# EAGLE schematic s16_panel_2 (EAGLE 7.3.0)

## Sheet 1 of 2
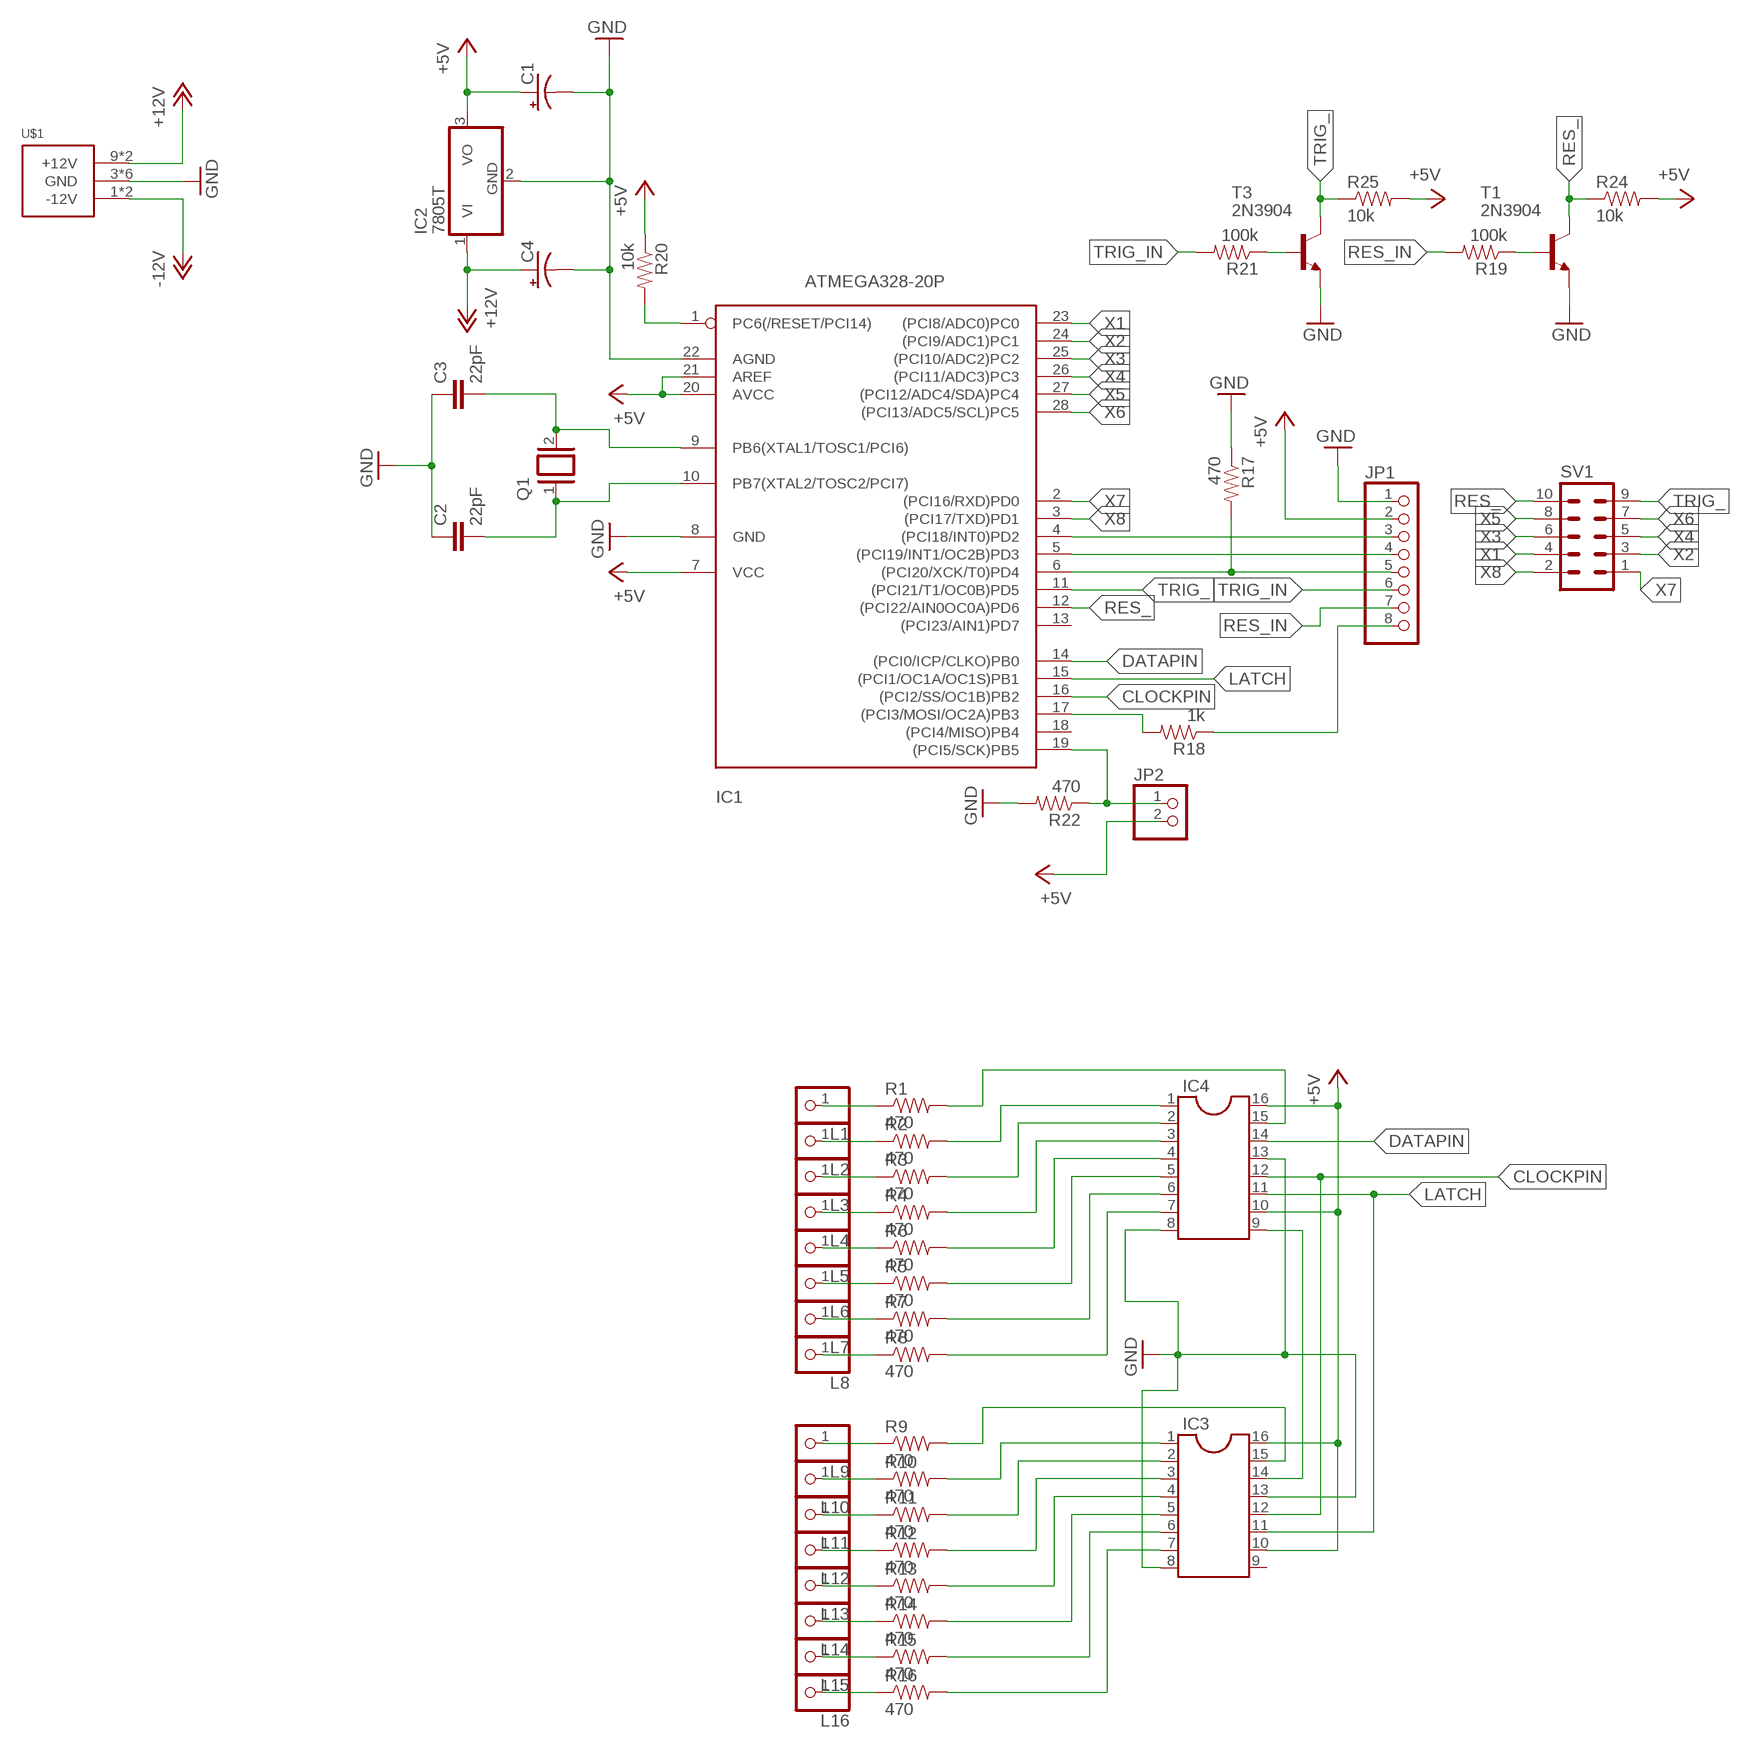
[diagram p0: schematic, sheet 1]

### Parts
C1  CAP_POLPTH2  [CPOL-RADIAL-10UF-25V]
C2  22pF  CAPEZ  [CAP-PTH-SMALLEZ]
C3  22pF  CAPEZ  [CAP-PTH-SMALLEZ]
C4  CAP_POLPTH2  [CPOL-RADIAL-10UF-25V]
IC1  ATMEGA328-20P  [DIL28-3]
IC2  7805T  [TO220H]
IC3  DIL16  [DIL16]
IC4  DIL16  [DIL16]
JP1  PINHD-1X8BIG  [1X08-BIG]
JP2  PINHD-1X2  [1X02]
L1  PINHD-1X1  [1X01]
L2  PINHD-1X1  [1X01]
L3  PINHD-1X1  [1X01]
L4  PINHD-1X1  [1X01]
L5  PINHD-1X1  [1X01]
L6  PINHD-1X1  [1X01]
L7  PINHD-1X1  [1X01]
L8  PINHD-1X1  [1X01]
L9  PINHD-1X1  [1X01]
L10  PINHD-1X1  [1X01]
L11  PINHD-1X1  [1X01]
L12  PINHD-1X1  [1X01]
L13  PINHD-1X1  [1X01]
L14  PINHD-1X1  [1X01]
L15  PINHD-1X1  [1X01]
L16  PINHD-1X1  [1X01]
Q1  XTAL/S  [QS]
R1  470  RESISTOR  [AXIAL-0.3]
R2  470  RESISTORAXIAL-0.3  [AXIAL-0.3]
R3  470  RESISTORAXIAL-0.3  [AXIAL-0.3]
R4  470  RESISTORAXIAL-0.3  [AXIAL-0.3]
R5  470  RESISTORAXIAL-0.3  [AXIAL-0.3]
R6  470  RESISTORAXIAL-0.3  [AXIAL-0.3]
R7  470  RESISTORAXIAL-0.3  [AXIAL-0.3]
R8  470  RESISTORAXIAL-0.3  [AXIAL-0.3]
R9  470  RESISTORAXIAL-0.3  [AXIAL-0.3]
R10  470  RESISTORAXIAL-0.3  [AXIAL-0.3]
R11  470  RESISTORAXIAL-0.3  [AXIAL-0.3]
R12  470  RESISTORAXIAL-0.3  [AXIAL-0.3]
R13  470  RESISTORAXIAL-0.3  [AXIAL-0.3]
R14  470  RESISTORAXIAL-0.3  [AXIAL-0.3]
R15  470  RESISTORAXIAL-0.3  [AXIAL-0.3]
R16  470  RESISTORAXIAL-0.3  [AXIAL-0.3]
R17  470  RESISTORAXIAL-0.3  [AXIAL-0.3]
R18  1k  RESISTORAXIAL-0.3  [AXIAL-0.3]
R19  100k  RESISTORAXIAL-0.3  [AXIAL-0.3]
R20  10k  RESISTORAXIAL-0.3  [AXIAL-0.3]
R21  100k  RESISTORAXIAL-0.3  [AXIAL-0.3]
R22  470  RESISTOR  [AXIAL-0.3]
R24  10k  RESISTORAXIAL-0.3  [AXIAL-0.3]
R25  10k  RESISTORAXIAL-0.3  [AXIAL-0.3]
SV1  MA05-2  [MA05-2]
T1  2N3904  [TO92]
T3  2N3904  [TO92]
U$1  POWER_SIMPLE10  [POWER_10]

### Nets
+5V: C1.1(+) IC1.7(VCC) IC1.20(AVCC) IC1.21(AREF) IC2.3(VO) IC3.10 IC3.16 IC4.10 IC4.16 JP1.2 JP2.2 R20.P$1 R24.P$2 R25.P$2
+12V: C4.1(+) IC2.1(VI) U$1.9(+12V) U$1.10(+12V)
-12V: U$1.1(-12V) U$1.2(-12V)
CLOCKPIN: IC1.16((PCI2/SS/OC1B)PB2) IC3.12 IC4.12
DATAPIN: IC1.14((PCI0/ICP/CLKO)PB0) IC4.14
GND: C1.2(-) C2.1 C3.1 C4.2(-) IC1.8(GND) IC1.22(AGND) IC2.2(GND) IC3.8 IC3.13 IC4.8 IC4.13 JP1.1 R17.P$1 R22.P$2 T1.3(E) T3.3(E) U$1.3(GND) U$1.4(GND) U$1.5(GND) U$1.6(GND) U$1.7(GND) U$1.8(GND)
LATCH: IC1.15((PCI1/OC1A/OC1S)PB1) IC3.11 IC4.11
N$1: C2.2 IC1.10(PB7(XTAL2/TOSC2/PCI7)) Q1.1
N$2: C3.2 IC1.9(PB6(XTAL1/TOSC1/PCI6)) Q1.2
N$3: IC1.4((PCI18/INT0)PD2) JP1.3
N$4: IC1.17((PCI3/MOSI/OC2A)PB3) R18.P$2
N$5: IC1.5((PCI19/INT1/OC2B)PD3) JP1.4
N$6: JP1.8 R18.P$1
N$7: IC1.1(PC6(/RESET/PCI14)) R20.P$2
N$8: IC1.6((PCI20/XCK/T0)PD4) JP1.5 R17.P$2
N$9: IC1.19((PCI5/SCK)PB5) JP2.1 R22.P$1
N$13: IC4.15 R1.P$2
N$14: IC4.1 R2.P$2
N$15: IC4.2 R3.P$2
N$16: IC4.3 R4.P$2
N$17: IC4.4 R6.P$2
N$18: IC4.5 R5.P$2
N$19: IC4.6 R7.P$2
N$20: IC4.7 R8.P$2
N$21: IC3.15 R9.P$2
N$22: IC3.1 R10.P$2
N$23: IC3.2 R11.P$2
N$24: IC3.3 R12.P$2
N$25: IC3.4 R13.P$2
N$26: IC3.5 R14.P$2
N$27: IC3.6 R15.P$2
N$28: IC3.7 R16.P$2
N$29: IC3.14 IC4.9
N$30: L1.1 R1.P$1
N$31: L2.1 R2.P$1
N$32: L3.1 R3.P$1
N$33: L4.1 R4.P$1
N$34: L5.1 R6.P$1
N$35: L6.1 R5.P$1
N$36: L7.1 R7.P$1
N$37: L8.1 R8.P$1
N$38: L9.1 R9.P$1
N$39: L10.1 R10.P$1
N$40: L11.1 R11.P$1
N$41: L12.1 R12.P$1
N$42: L13.1 R13.P$1
N$43: L14.1 R14.P$1
N$44: L15.1 R15.P$1
N$45: L16.1 R16.P$1
N$55: R21.P$1 T3.2(B)
N$74: R19.P$1 T1.2(B)
RES_: IC1.12((PCI22/AIN0OC0A)PD6) R24.P$1 SV1.10 T1.1(C)
RES_IN: JP1.7 R19.P$2
TRIG_: IC1.11((PCI21/T1/OC0B)PD5) R25.P$1 SV1.9 T3.1(C)
TRIG_IN: JP1.6 R21.P$2
X1: IC1.23((PCI8/ADC0)PC0) SV1.4
X2: IC1.24((PCI9/ADC1)PC1) SV1.3
X3: IC1.25((PCI10/ADC2)PC2) SV1.6
X4: IC1.26((PCI11/ADC3)PC3) SV1.5
X5: IC1.27((PCI12/ADC4/SDA)PC4) SV1.8
X6: IC1.28((PCI13/ADC5/SCL)PC5) SV1.7
X7: IC1.2((PCI16/RXD)PD0) SV1.1
X8: IC1.3((PCI17/TXD)PD1) SV1.2
Unconnected: IC1.13((PCI23/AIN1)PD7) IC1.18((PCI4/MISO)PB4) IC3.9

## Sheet 2 of 2

## Library data of the parts
C1 C4 = SparkFun-Passives:CAP_POL: Capacitor Polarized These are standard SMD and PTH capacitors. Normally 10uF, 47uF, and 100uF in electrolytic and tantalum varieties. Always verify the external diameter of the through hole cap, it varies with capacity, voltage, and manufacturer. The EIA devices should be standard.
C2 C3 = SparkFun-Passives:CAP: Capacitor Standard 0603 ceramic capacitor, and 0.1" leaded capacitor.
IC1 = atmega328:ATMEGA328*P: MICROCONTROLLER 32 kBytes FLASH 2 kBytes SRAM 1 kBytes EEPROM USART 8-channel 10 bit ADC
IC2 = adafruit:78*: Positive VOLTAGE REGULATOR Added bigger pads to the TO-92 package
IC3 IC4 = ic-package:DIL16: Dual In Line / Socket
JP1 = adafruit:PINHD-1X8: PIN HEADER
JP2 = pinhead:PINHD-1X2: PIN HEADER
L1-L16 = adafruit:PINHD-1X1: Pin header 1x1 for 0.1" spacing With round pins
Q1 = special:XTAL/S: CRYSTAL
R1-R22 R24 R25 = SparkFun-Passives:RESISTOR: Resistor Basic schematic elements and footprints for 0603, 1206, and PTH resistors.
SV1 = con-lstb:MA05-2: PIN HEADER; OC_FARNELL: unknown; OC_NEWARK: unknown
T1 T3 = transistor:2N3904: NPN TRANSISTOR
U$1 = eurorack:POWER_SIMPLE